# EAGLE design Hall_Sensor (EAGLE 9.2.0)
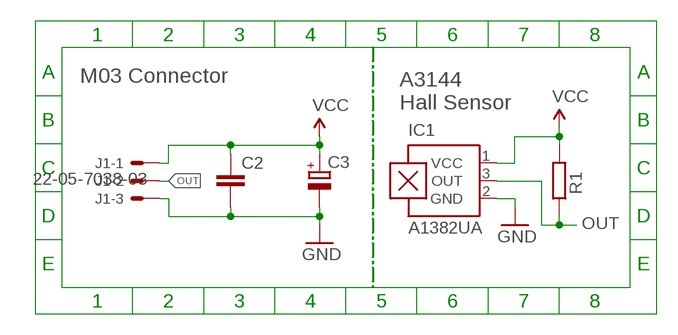
[diagram p0: schematic, sheet 1]

## Parts
C2  C-EU025-025X050  [C025-025X050]
C3  CPOL-EUE2,5-6E  [E2,5-6E]
IC1  A1382UA  [SIP3-UA]
J1  22-05-7038-03  [7395-03]
R1  R-EU_0207/7  [0207/7]

## Nets
GND: C2.2 C3.- IC1.2(GND) J1.3
OUT: IC1.3(OUT) J1.2 R1.1
VCC: C2.1 C3.+ IC1.1(VCC) J1.1 R1.2

## Notes on the sheet
- M03 Connector
- A3144 
  Hall Sensor

## Library data of the parts
C2 = rcl:C-EU: CAPACITOR, European symbol
C3 = resistor:CPOL-EU: POLARIZED CAPACITOR, European symbol
IC1 = allegro:A13*?: Linear Hall Effect Sensor ICs Continuous-Time Ratiometric High-Temperature Operation Programmable Linear with Analog Output A1302 -Replacement- UGN3503 Source: http://www.allegromicro.com/en/Products/Part_Numbers/1301/1301.pdf http://www.allegromicro.com/en/Products/Part_Numbers/1321/1321.pdf http://www.allegromicro.com/en/Products/Part_Numbers/1381/1381.pdf; MPN: A1382LUA-T; OC_FARNELL: unknown; OC_NEWARK: 30M9953
J1 = con-molex:22-?-03: CONNECTOR wire to board 2.54 mm (.1 inch) pitch header; MF: MOLEX; OC_FARNELL: unknown; OC_NEWARK: unknown
R1 = rcl:R-EU_: RESISTOR, European symbol; SPICEPREFIX: R

## Board
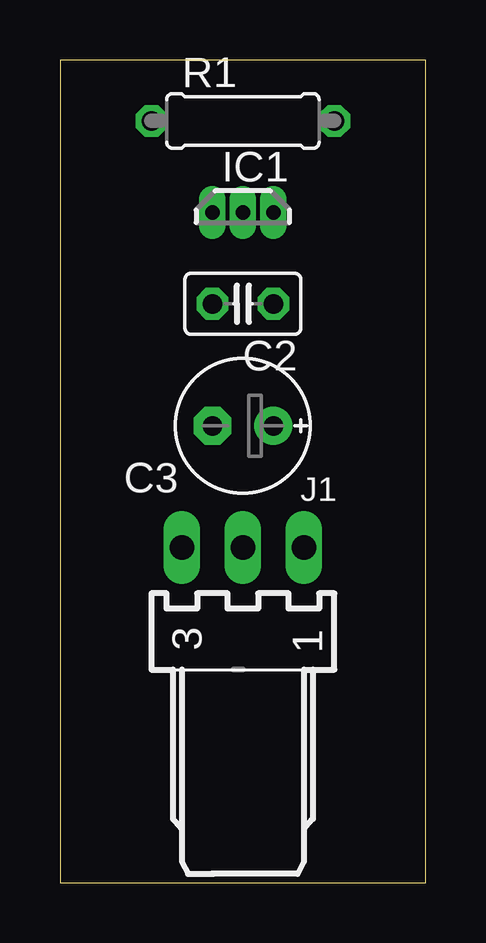
[diagram p1: board, top side]
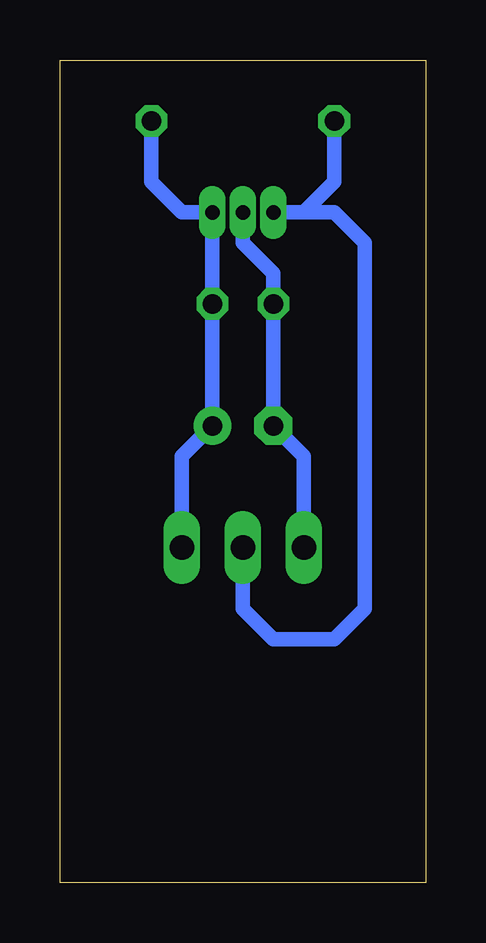
[diagram p2: board, bottom side, seen from below]

Size 15.24 x 34.29 mm. Coordinates in mm from the lower left corner, seen from the top.
Outline: 0,0 15.24,0 15.24,34.29 0,34.29 0,0
Copper layers (1*16): Top 0.035mm / dielectric 1.5mm / Bottom 0.035mm
Design rules "default": minimum track width 6mil, minimum drill 0.35mm, track to track 6mil, track to pad 6mil, pad to pad 6mil, via to via 6mil, smd to smd 6mil, copper to edge 40mil, drill to drill 6mil, minimum pad ring 10mil, minimum via ring 8mil, stop-mask expansion 4mil, vias tented up to drill 0mil, thermal gap 10mil

### Footprints (pad centres in the part's own frame; a part is rotated, then mirrored left to right if it is on the bottom)
C025-025X050 = drill 0.813 octagon: 1 -1.27,0; 2 1.27,0
E2,5-6E = drill 0.813 pad 1.575: + -1.27,0 | drill 0.813 pad 1.575 octagon: - 1.27,0
SIP3-UA = drill 0.6 pad 0.7 long: 1 -1.27,0; 2 0,0; 3 1.27,0
7395-03 = drill 1.016 long: 1 2.54,0; 2 0,0; 3 -2.54,0
0207/7 = drill 0.813 octagon: 1 -3.81,0; 2 3.81,0

### Placement (x,y rotation side)
C2  7.62,24.13 180 top
C3  7.62,19.05 180 top
IC1  7.62,27.94 180 top
J1  7.62,13.97 0 top
R1  7.62,31.75 0 top

### Tracks (layer width: path | path; a pad name or v marks a point on that pad's centre or on a via)
GND
  Bottom 0.61: J1.3 5.08,17.78 C3.- C2.2 6.35,25.4 7.62,26.67 IC1.2
OUT
  Bottom 0.61: IC1.3 5.08,27.94 | 5.08,27.94 3.81,27.94 2.54,26.67 2.54,11.43 3.81,10.16 6.35,10.16 7.62,11.43 J1.2 | 5.08,27.94 3.81,29.21 R1.1
VCC
  Bottom 0.61: J1.1 10.16,17.78 C3.+ C2.1 IC1.1 10.16,27.94 11.43,29.21 R1.2